# EAGLE design Rev 2 (EAGLE 9.2.2)

## Sheet 1 of 5: Power
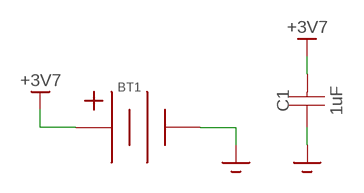
[diagram p0: schematic, sheet 1]

### Parts
BT1  18650  [18650]
C1  1uF  CAPACITOR0805  [0805]

### Nets
+3V7: BT1.+1(+) BT1.+2(+) BT1.+3(+) C1.P$2 ; also sheet 2,4,5
GND: BT1.-1(-) BT1.-2(-) BT1.-3(-) C1.P$1 ; also sheet 2,3,4,5

## Sheet 2 of 5: Pi
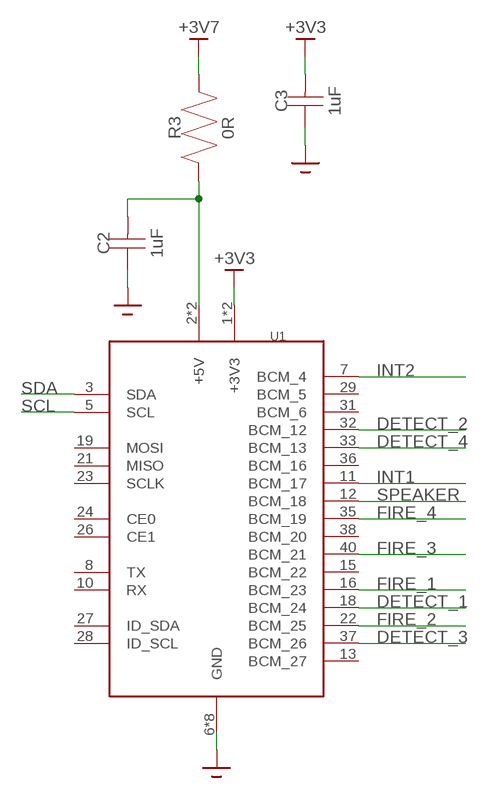
[diagram p1: schematic, sheet 2]

### Parts
C2  1uF  CAPACITOR0805  [0805]
C3  1uF  CAPACITOR0805  [0805]
R3  0R  RESISTOR0805  [0805]
U1  RPI-ZERO  [RPI-ZERO]

### Nets
+3V3: C3.P$2 U1.1(+3V3) U1.17(+3V3) ; also sheet 3,4
+3V7: R3.P$2 ; also sheet 1,4,5
DETECT_1: U1.18(BCM_24) ; also sheet 4
DETECT_2: U1.32(BCM_12) ; also sheet 4
DETECT_3: U1.37(BCM_26) ; also sheet 4
DETECT_4: U1.33(BCM_13) ; also sheet 4
FIRE_1: U1.16(BCM_23) ; also sheet 4
FIRE_2: U1.22(BCM_25) ; also sheet 4
FIRE_3: U1.40(BCM_21) ; also sheet 4
FIRE_4: U1.35(BCM_19) ; also sheet 4
GND: C2.P$1 C3.P$1 U1.6(GND) U1.9(GND) U1.14(GND) U1.20(GND) U1.25(GND) U1.30(GND) U1.34(GND) U1.39(GND) ; also sheet 1,3,4,5
INT1: U1.11(BCM_17) ; also sheet 3
INT2: U1.7(BCM_4) ; also sheet 3
N$4: C2.P$2 R3.P$1 U1.2(+5V) U1.4(+5V)
SCL: U1.5(SCL) ; also sheet 3
SDA: U1.3(SDA) ; also sheet 3
SPEAKER: U1.12(BCM_18) ; also sheet 5
Unconnected: U1.8(TX) U1.10(RX) U1.13(BCM_27) U1.15(BCM_22) U1.19(MOSI) U1.21(MISO) U1.23(SCLK) U1.24(CE0) U1.26(CE1) U1.27(ID_SDA) U1.28(ID_SCL) U1.29(BCM_5) U1.31(BCM_6) U1.36(BCM_16) U1.38(BCM_20)

## Sheet 3 of 5: Sensors
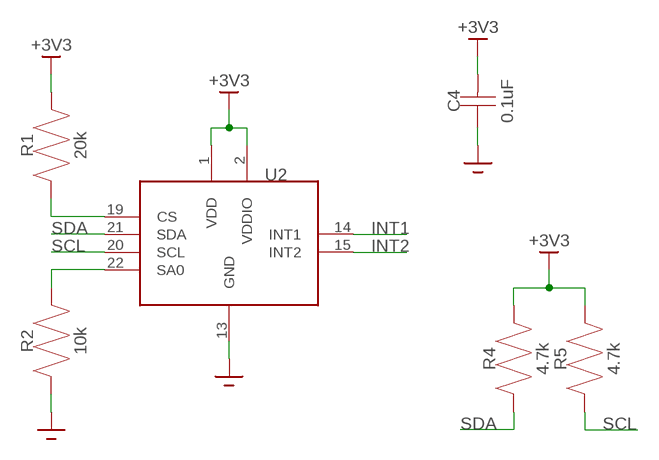
[diagram p2: schematic, sheet 3]

### Parts
C4  0.1uF  CAPACITOR0805  [0805]
R1  20k  RESISTOR0805  [0805]
R2  10k  RESISTOR0805  [0805]
R4  4.7k  RESISTOR0805  [0805]
R5  4.7k  RESISTOR0805  [0805]
U2  STEVAL-MKIT01V1  [DIP1524W53P254L3302H1000Q24B]

### Nets
+3V3: C4.P$2 R1.P$2 R4.P$2 R5.P$2 U2.1(VDD) U2.2(VDDIO) ; also sheet 2,4
GND: C4.P$1 R2.P$1 U2.13(GND) ; also sheet 1,2,4,5
INT1: U2.14(INT1) ; also sheet 2
INT2: U2.15(INT2) ; also sheet 2
N$2: R1.P$1 U2.19(CS)
N$3: R2.P$2 U2.22(SA0)
SCL: R5.P$1 U2.20(SCL) ; also sheet 2
SDA: R4.P$1 U2.21(SDA) ; also sheet 2

## Sheet 4 of 5: Charges
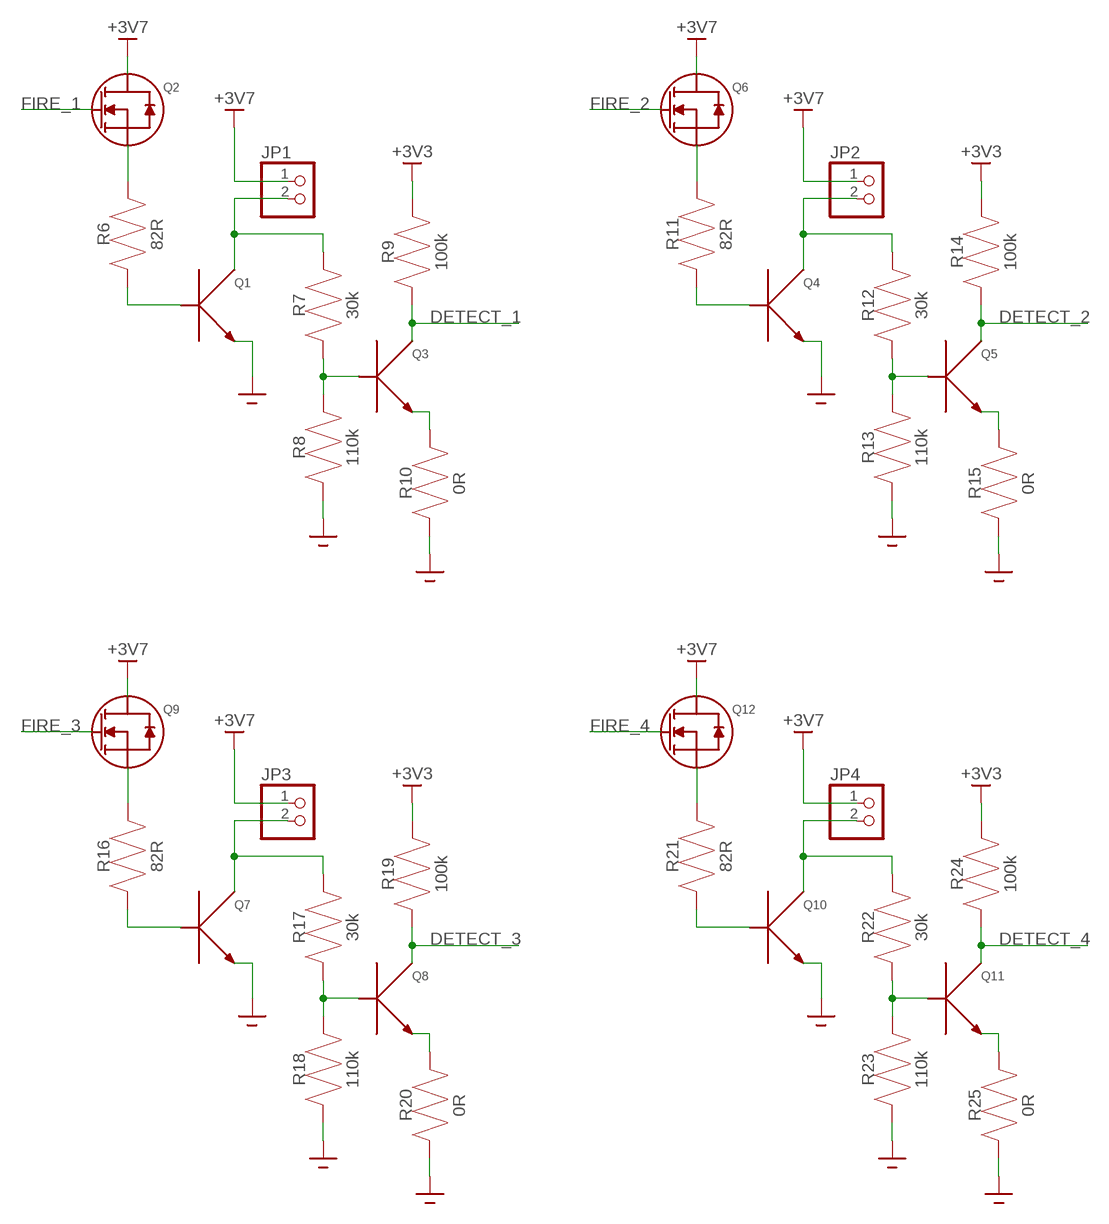
[diagram p3: schematic, sheet 4]

### Parts
JP1  PINHD-1X2  [1X02]
JP2  PINHD-1X2  [1X02]
JP3  PINHD-1X2  [1X02]
JP4  PINHD-1X2  [1X02]
Q1  3STF1640  [3STF1640]
Q2  DMN601K  [SOT91P240X110-3]
Q3  MMBT3904  [SOT96P237X112-3]
Q4  3STF1640  [3STF1640]
Q5  MMBT3904  [SOT96P237X112-3]
Q6  DMN601K  [SOT91P240X110-3]
Q7  3STF1640  [3STF1640]
Q8  MMBT3904  [SOT96P237X112-3]
Q9  DMN601K  [SOT91P240X110-3]
Q10  3STF1640  [3STF1640]
Q11  MMBT3904  [SOT96P237X112-3]
Q12  DMN601K  [SOT91P240X110-3]
R6  82R  RESISTOR0805  [0805]
R7  30k  RESISTOR0805  [0805]
R8  110k  RESISTOR0805  [0805]
R9  100k  RESISTOR0805  [0805]
R10  0R  RESISTOR0805  [0805]
R11  82R  RESISTOR0805  [0805]
R12  30k  RESISTOR0805  [0805]
R13  110k  RESISTOR0805  [0805]
R14  100k  RESISTOR0805  [0805]
R15  0R  RESISTOR0805  [0805]
R16  82R  RESISTOR0805  [0805]
R17  30k  RESISTOR0805  [0805]
R18  110k  RESISTOR0805  [0805]
R19  100k  RESISTOR0805  [0805]
R20  0R  RESISTOR0805  [0805]
R21  82R  RESISTOR0805  [0805]
R22  30k  RESISTOR0805  [0805]
R23  110k  RESISTOR0805  [0805]
R24  100k  RESISTOR0805  [0805]
R25  0R  RESISTOR0805  [0805]

### Nets
+3V3: R9.P$2 R14.P$2 R19.P$2 R24.P$2 ; also sheet 2,3
+3V7: JP1.1 JP2.1 JP3.1 JP4.1 Q2.3(D) Q6.3(D) Q9.3(D) Q12.3(D) ; also sheet 1,2,5
DETECT_1: Q3.3(C) R9.P$1 ; also sheet 2
DETECT_2: Q5.3(C) R14.P$1 ; also sheet 2
DETECT_3: Q8.3(C) R19.P$1 ; also sheet 2
DETECT_4: Q11.3(C) R24.P$1 ; also sheet 2
FIRE_1: Q2.1(G) ; also sheet 2
FIRE_2: Q6.1(G) ; also sheet 2
FIRE_3: Q9.1(G) ; also sheet 2
FIRE_4: Q12.1(G) ; also sheet 2
GND: Q1.P3(E) Q4.P3(E) Q7.P3(E) Q10.P3(E) R8.P$1 R10.P$1 R13.P$1 R15.P$1 R18.P$1 R20.P$1 R23.P$1 R25.P$1 ; also sheet 1,2,3,5
N$1: Q2.2(S) R6.P$2
N$5: JP1.2 Q1.P2(C) Q1.P4(C) Q1.P5(C) R7.P$2
N$6: Q3.2(E) R10.P$2
N$7: Q1.P1(B) R6.P$1
N$8: Q3.1(B) R7.P$1 R8.P$2
N$9: Q6.2(S) R11.P$2
N$10: JP2.2 Q4.P2(C) Q4.P4(C) Q4.P5(C) R12.P$2
N$11: Q4.P1(B) R11.P$1
N$12: Q5.1(B) R12.P$1 R13.P$2
N$13: Q5.2(E) R15.P$2
N$14: Q9.2(S) R16.P$2
N$15: JP3.2 Q7.P2(C) Q7.P4(C) Q7.P5(C) R17.P$2
N$16: Q7.P1(B) R16.P$1
N$17: Q8.1(B) R17.P$1 R18.P$2
N$18: Q8.2(E) R20.P$2
N$19: Q12.2(S) R21.P$2
N$20: JP4.2 Q10.P2(C) Q10.P4(C) Q10.P5(C) R22.P$2
N$21: Q10.P1(B) R21.P$1
N$22: Q11.1(B) R22.P$1 R23.P$2
N$23: Q11.2(E) R25.P$2

## Sheet 5 of 5: Speaker
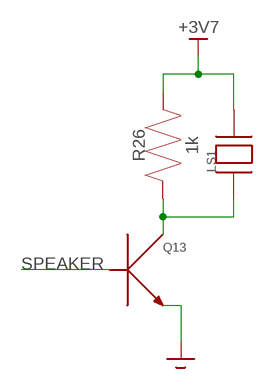
[diagram p4: schematic, sheet 5]

### Parts
LS1  PKM13EPYH4000-A0  [PKM13EPYH4000-A0]
Q13  MMBT3904  [SOT96P237X112-3]
R26  1k  RESISTOR0805  [0805]

### Nets
+3V7: LS1.P2 R26.P$2 ; also sheet 1,2,4
GND: Q13.2(E) ; also sheet 1,2,3,4
N$24: LS1.P1 Q13.3(C) R26.P$1
SPEAKER: Q13.1(B) ; also sheet 2

## Library data of the parts
BT1 = Control Cluster Rocket:18650
C1-C4 = Control Cluster Rocket:CAPACITOR
JP1-JP4 = Control Cluster Rocket:PINHD-1X2: PIN HEADER
LS1 = Control Cluster Rocket:PKM13EPYH4000-A0
Q1 Q4 Q7 Q10 = Control Cluster Rocket:3STF1640
Q2 Q6 Q9 Q12 = Control Cluster Rocket:DMN601K
Q3 Q5 Q8 Q11 Q13 = Control Cluster Rocket:MMBT3904
R1-R26 = Control Cluster Rocket:RESISTOR
U1 = Control Cluster Rocket:RPI-ZERO
U2 = Control Cluster Rocket:STEVAL-MKIT01V1

## Board
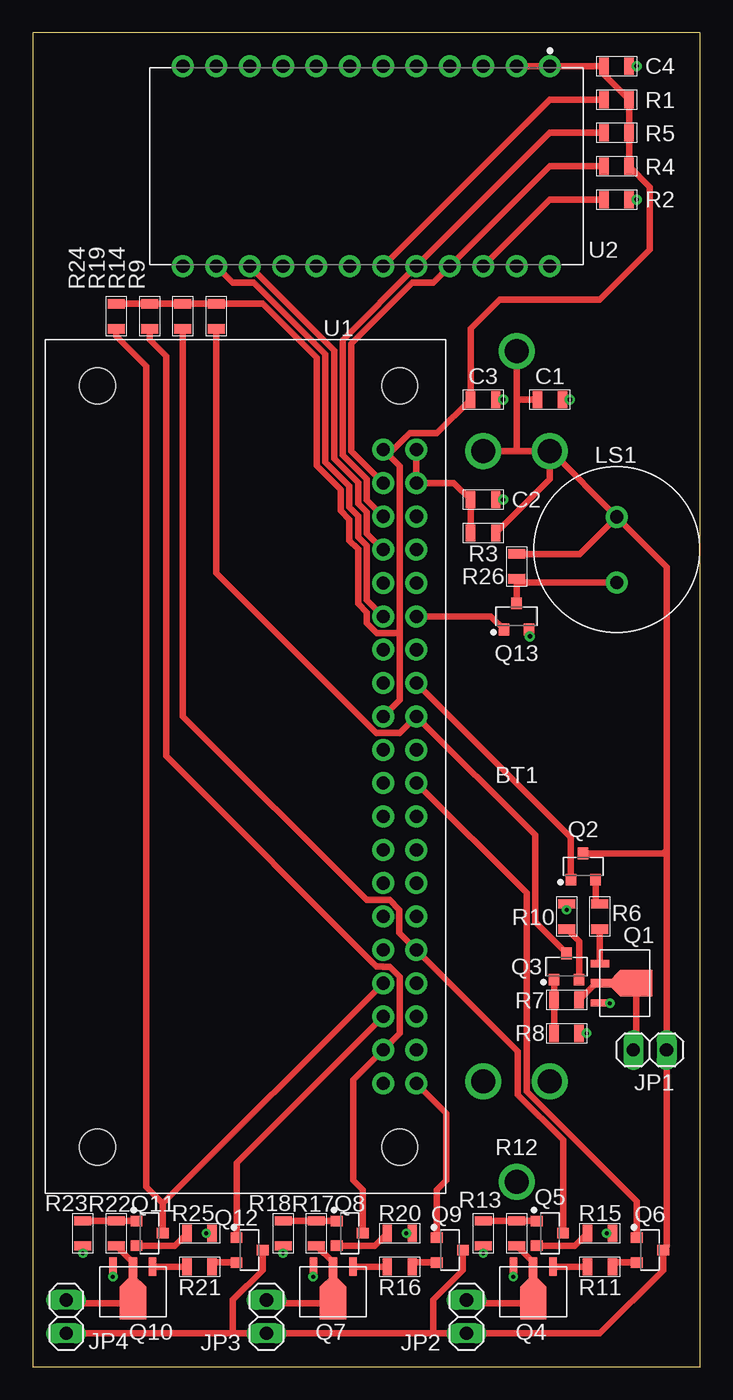
[diagram p5: board, top side]
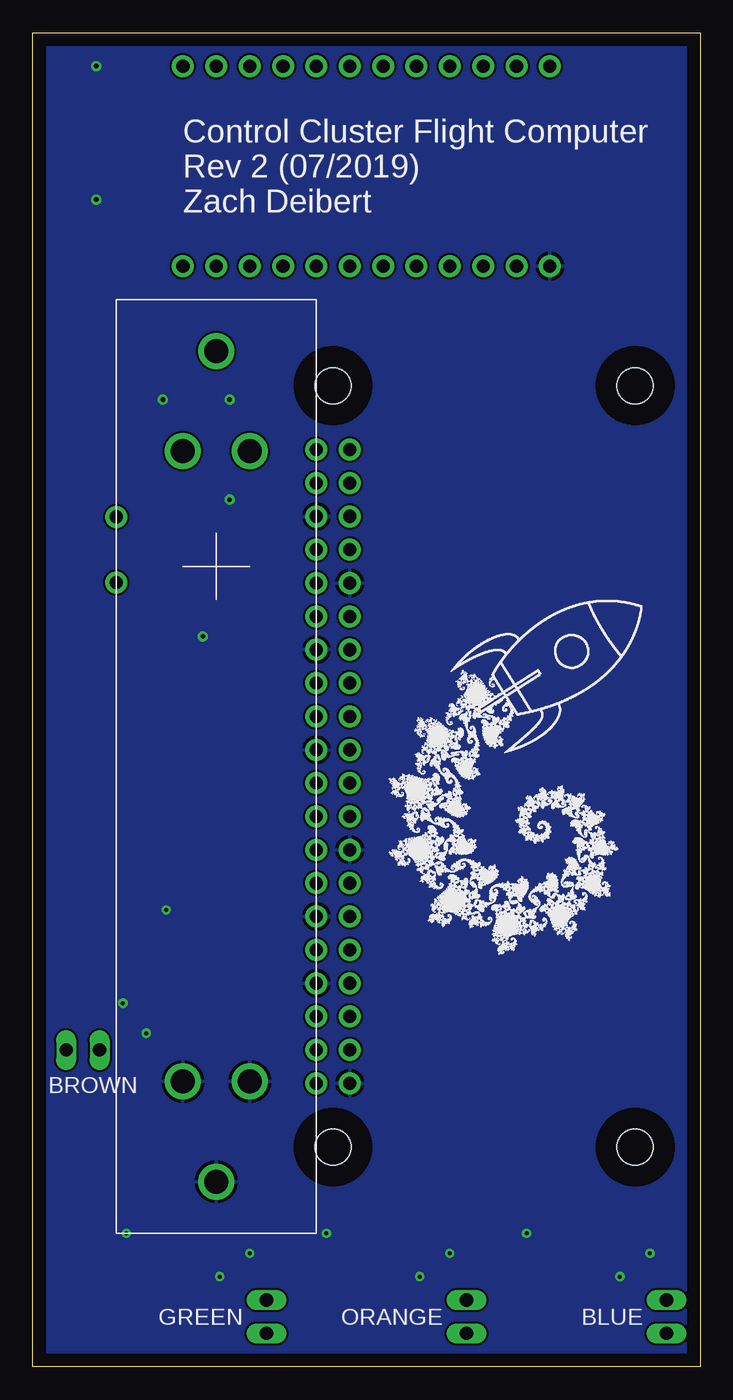
[diagram p6: board, bottom side, seen from below]

Size 50.8 x 101.6 mm. Coordinates in mm from the lower left corner, seen from the top.
Outline: 0,0 50.8,0 50.8,101.6 0,101.6 0,0
Copper layers (1*16): Top 0.035mm / dielectric 1.5mm / Bottom 0.035mm
Design rules "default *": minimum track width 6mil, minimum drill 0.3mm, track to track 6mil, track to pad 6mil, pad to pad 6mil, via to via 6mil, smd to smd 0mil, copper to edge 40mil, drill to drill 6mil, minimum pad ring 10mil, minimum via ring 8mil, stop-mask expansion 4mil, vias tented up to drill 0mil, thermal gap 10mil

### Footprints (pad centres in the part's own frame; a part is rotated, then mirrored left to right if it is on the bottom)
18650 = drill 1.829: +1 -24.003,2.54; +2 -24.003,-2.54; +3 -31.623,0; -1 24.003,2.54; -2 24.003,-2.54; -3 31.623,0
0805 = smd 0.711 x 1.295: P$1 -0.953,0; P$2 0.953,0
1X02 = drill 1.016 long: 1 -1.27,0; 2 1.27,0
PKM13EPYH4000-A0 = drill 1 pad 1.676: P1 -2.5,0; P2 2.5,0
3STF1640 = smd 0.57 x 1.4: P1 -1.5,0; P3 1.5,0 | smd 0.65 x 1.575: P2 0,0.087 | smd 2 x 2.45: P4 0,2.775 | smd 1.414 x 1.414 rotated 45: P5 0,1.55
SOT91P240X110-3 = smd 0.9 x 0.8: 1 -1,0.95; 2 -1,-0.95; 3 1,0
SOT96P237X112-3 = smd 0.9 x 0.8: 1 -1,0.95; 2 -1,-0.95; 3 1,0
RPI-ZERO = drill 1 pad 1.676: 1 -1.27,24.13; 2 1.27,24.13; 3 -1.27,21.59; 4 1.27,21.59; 5 -1.27,19.05; 6 1.27,19.05; 7 -1.27,16.51; 8 1.27,16.51; 9 -1.27,13.97; 10 1.27,13.97; 11 -1.27,11.43; 12 1.27,11.43; 13 -1.27,8.89; 14 1.27,8.89; 15 -1.27,6.35; 16 1.27,6.35; 17 -1.27,3.81; 18 1.27,3.81; 19 -1.27,1.27; 20 1.27,1.27; 21 -1.27,-1.27; 22 1.27,-1.27; 23 -1.27,-3.81; 24 1.27,-3.81; 25 -1.27,-6.35; 26 1.27,-6.35; 27 -1.27,-8.89; 28 1.27,-8.89; 29 -1.27,-11.43; 30 1.27,-11.43; 31 -1.27,-13.97; 32 1.27,-13.97; 33 -1.27,-16.51; 34 1.27,-16.51; 35 -1.27,-19.05; 36 1.27,-19.05; 37 -1.27,-21.59; 38 1.27,-21.59; 39 -1.27,-24.13; 40 1.27,-24.13 | hole 2.75: 0,29; 0,-29; -23,29; -23,-29
DIP1524W53P254L3302H1000Q24B = drill 1 pad 1.676: 1 -7.62,13.97; 2 -7.62,11.43; 3 -7.62,8.89; 4 -7.62,6.35; 5 -7.62,3.81; 6 -7.62,1.27; 7 -7.62,-1.27; 8 -7.62,-3.81; 9 -7.62,-6.35; 10 -7.62,-8.89; 11 -7.62,-11.43; 12 -7.62,-13.97; 13 7.62,-13.97; 14 7.62,-11.43; 15 7.62,-8.89; 16 7.62,-6.35; 17 7.62,-3.81; 18 7.62,-1.27; 19 7.62,1.27; 20 7.62,3.81; 21 7.62,6.35; 22 7.62,8.89; 23 7.62,11.43; 24 7.62,13.97

### Placement (x,y rotation side)
BT1  36.83,45.72 270 bottom
C1  39.37,73.66 180 top
C2  34.29,66.04 180 top
C3  34.29,73.66 180 top
C4  44.45,99.06 180 top
JP1  46.99,24.13 180 top
JP2  33.02,3.81 90 top
JP3  17.78,3.81 90 top
JP4  2.54,3.81 90 top
LS1  44.45,62.23 90 top
Q1  43.18,29.21 270 top
Q2  41.91,38.1 90 top
Q3  40.64,30.48 90 top
Q4  38.1,7.62 180 top
Q5  39.37,10.16 0 top
Q6  46.99,8.89 0 top
Q7  22.86,7.62 180 top
Q8  24.13,10.16 0 top
Q9  31.75,8.89 0 top
Q10  7.62,7.62 180 top
Q11  8.89,10.16 0 top
Q12  16.51,8.89 0 top
Q13  36.83,57.15 90 top
R1  44.45,96.52 0 top
R2  44.45,88.9 180 top
R3  34.29,63.5 0 top
R4  44.45,91.44 0 top
R5  44.45,93.98 0 top
R6  43.18,34.29 90 top
R7  40.64,27.94 0 top
R8  40.64,25.4 180 top
R9  13.97,80.01 90 top
R10  40.64,34.29 270 top
R11  43.18,7.62 0 top
R12  36.83,10.16 270 top
R13  34.29,10.16 90 top
R14  11.43,80.01 90 top
R15  43.18,10.16 180 top
R16  27.94,7.62 0 top
R17  21.59,10.16 270 top
R18  19.05,10.16 90 top
R19  8.89,80.01 90 top
R20  27.94,10.16 180 top
R21  12.7,7.62 0 top
R22  6.35,10.16 270 top
R23  3.81,10.16 90 top
R24  6.35,80.01 90 top
R25  12.7,10.16 180 top
R26  36.83,60.96 90 top
U1  27.94,45.72 0 top
U2  25.4,91.44 270 top

### Tracks (layer width: path | path; a pad name or v marks a point on that pad's centre or on a via)
+3V3
  Top 0.508: U2.2 U2.1 C4.P$2 43.5,98.42 R1.P$2 R5.P$2 R4.P$2 46.99,89.85 46.99,85.09 43.18,81.28 35.56,81.28 33.34,79.06 C3.P$2 30.77,71.09 28.69,71.09 27.45,69.85 U1.1 27.94,68.58 27.94,55.88 | U1.17 27.94,50.8 27.94,55.88 | R24.P$2 R19.P$2 R14.P$2 R9.P$2 17.5,80.96 21.61,76.85 21.61,68.63 23.44,66.8 23.44,65.19 24.11,64.53 24.11,62.93 24.77,62.27 24.77,58.12 25.43,57.46 25.43,56.63 26.18,55.88 27.94,55.88
+3V7
  Top 0.508: JP4.1 15.24,2.54 | 15.24,2.54 JP3.1 30.48,2.54 | Q12.3 17.51,7.35 15.24,5.08 15.24,2.54 | Q9.3 32.75,7.35 30.48,5.08 30.48,2.54 | 30.48,2.54 JP2.1 43.18,2.54 47.99,7.35 Q6.3 48.26,9.16 JP1.1 48.26,39.37 | BT1.+1 36.83,69.72 | 36.83,69.72 BT1.+2 | BT1.+3 36.83,73.66 | 36.83,73.66 36.83,69.72 | R3.P$2 39.37,67.63 BT1.+2 | C1.P$2 36.83,73.66 | BT1.+2 39.46,69.72 LS1.P2 | R26.P$2 41.63,61.91 LS1.P2 | 48.26,39.37 48.26,60.92 LS1.P2 | Q2.3 47.99,39.1 48.26,39.37
DETECT_1
  Top 0.508: Q3.3 38.25,33.87 38.25,40.49 U1.18 27.94,48.26 27.91,48.28 26.15,48.28 13.97,60.47 R9.P$1
DETECT_2
  Top 0.508: Q5.3 40.37,17.27 36.93,20.71 36.93,24.03 U1.32 27.91,33.05 27.91,34.81 27.19,35.53 25.43,35.53 11.43,49.53 R14.P$1
DETECT_3
  Top 0.508: Q8.3 25.13,13.46 24.38,14.21 24.38,21.84 U1.37 27.94,25.4 27.94,29.7 27.19,30.45 26.7,30.45 26.64,30.5 26.15,30.5 10.42,46.24 10.16,46.5 10.16,76.96 8.89,78.23 R19.P$1
DETECT_4
  Top 0.508: Q11.3 9.89,12.43 | 9.89,12.43 U1.33 | 9.89,12.43 8.62,13.7 8.62,74.53 8.64,74.55 8.64,76.2 6.35,78.49 R24.P$1
FIRE_1
  Top 0.508: Q2.1 40.96,40.32 U1.16
FIRE_2
  Top 0.508: Q6.1 45.99,12.58 37.59,20.98 37.59,36.07 U1.22
FIRE_3
  Top 0.508: Q9.1 30.75,13.46 31.5,14.21 31.5,19.3 U1.40
FIRE_4
  Top 0.508: Q12.1 15.51,15.51 U1.35
GND  (via drill 0.3, 0.35)
  Top 0.508: v3.81,8.64 R23.P$1 | v6.1,6.86 6.1,7.6 Q10.P3 | R25.P$1 v13.21,10.16 | v19.05,8.64 R18.P$1 | v21.34,6.86 21.34,7.6 Q7.P3 | v28.45,10.16 R20.P$1 | v34.29,8.64 R13.P$1 | Q4.P3 36.6,6.88 v36.58,6.86 | R15.P$1 v43.69,10.16 | v42.16,25.4 R8.P$1 | v43.94,27.69 43.2,27.69 Q1.P3 | v40.64,34.8 R10.P$1 | v37.85,55.63 37.78,55.69 Q13.2 | v35.81,66.04 C2.P$1 | v35.81,73.66 C3.P$1 | v40.89,73.66 C1.P$1 | v45.97,88.9 R2.P$1 | v45.97,99.06 C4.P$1
  pour Bottom: 0,101.6 50.8,101.6 50.8,0 0,0
INT1
  Top 0.508: U2.14 15.21,82.58 16.82,82.58 22.28,77.12 22.28,68.9 24.11,67.07 24.11,65.47 24.77,64.81 24.77,63.2 25.43,62.54 25.43,58.4 U1.11
INT2
  Top 0.508: U2.15 22.94,77.39 22.94,69.18 24.77,67.35 24.77,65.74 25.43,65.08 25.43,63.48 U1.7
N$1
  Top 0.508: R6.P$2 42.86,35.56 Q2.2
N$2
  Top 0.508: R1.P$1 39.37,96.52 U2.19
N$3
  Top 0.508: R2.P$2 39.37,88.9 U2.22
N$4
  Top 0.508: R3.P$1 C2.P$2 32.07,67.31 U1.4 U1.2
N$5
  Top 0.508: R7.P$2 42.86,29.21 Q1.P2 Q1.P5 Q1.P4 45.95,24.36 JP1.2
N$6
  Top 0.508: R10.P$2 41.59,32.39 Q3.2
N$7
  Top 0.508: Q1.P1 R6.P$1
N$8
  Top 0.508: R8.P$2 R7.P$1 Q3.1
N$9
  Top 0.508: R11.P$2 44.45,7.94 Q6.2
N$10
  Top 0.508: R12.P$2 38.1,7.94 Q4.P2 Q4.P5 Q4.P4 33.26,4.84 JP2.2
N$11
  Top 0.508: Q4.P1 R11.P$1
N$12
  Top 0.508: Q5.1 R12.P$1 R13.P$2
N$13
  Top 0.508: Q5.2 41.28,9.21 R15.P$2
N$14
  Top 0.508: R16.P$2 29.21,7.94 Q9.2
N$15
  Top 0.508: R17.P$2 22.86,7.94 Q7.P2 Q7.P5 Q7.P4 18.02,4.84 JP3.2
N$16
  Top 0.508: Q7.P1 R16.P$1
N$17
  Top 0.508: Q8.1 R17.P$1 R18.P$2
N$18
  Top 0.508: R20.P$2 26.04,9.21 Q8.2
N$19
  Top 0.508: R21.P$2 13.97,7.94 Q12.2
N$20
  Top 0.508: R22.P$2 7.62,7.94 Q10.P2 Q10.P5 Q10.P4 2.77,4.84 JP4.2
N$21
  Top 0.508: Q10.P1 R21.P$1
N$22
  Top 0.508: Q11.1 R22.P$1 R23.P$2
N$23
  Top 0.508: R25.P$2 10.8,9.21 Q11.2
N$24
  Top 0.508: Q13.3 R26.P$1 37.11,59.73 LS1.P1
SCL
  Top 0.508: R5.P$1 39.37,93.98 U2.20 23.6,78.21 23.6,69.45 25.43,67.62 25.43,66.02 U1.5
SDA
  Top 0.508: R4.P$1 39.37,91.44 U2.21 30.5,82.58 28.9,82.58 24.26,77.93 24.26,69.72 U1.3
SPEAKER
  Top 0.508: U1.12 34.88,57.15 Q13.1

### Text on the board
bNames: Control Cluster Flight Computer / Rev 2 (07/2019) / Zach Deibert | BROWN | BLUE | ORANGE | GREEN